# Altium schematic sheet Wifi.SchDoc
size A3
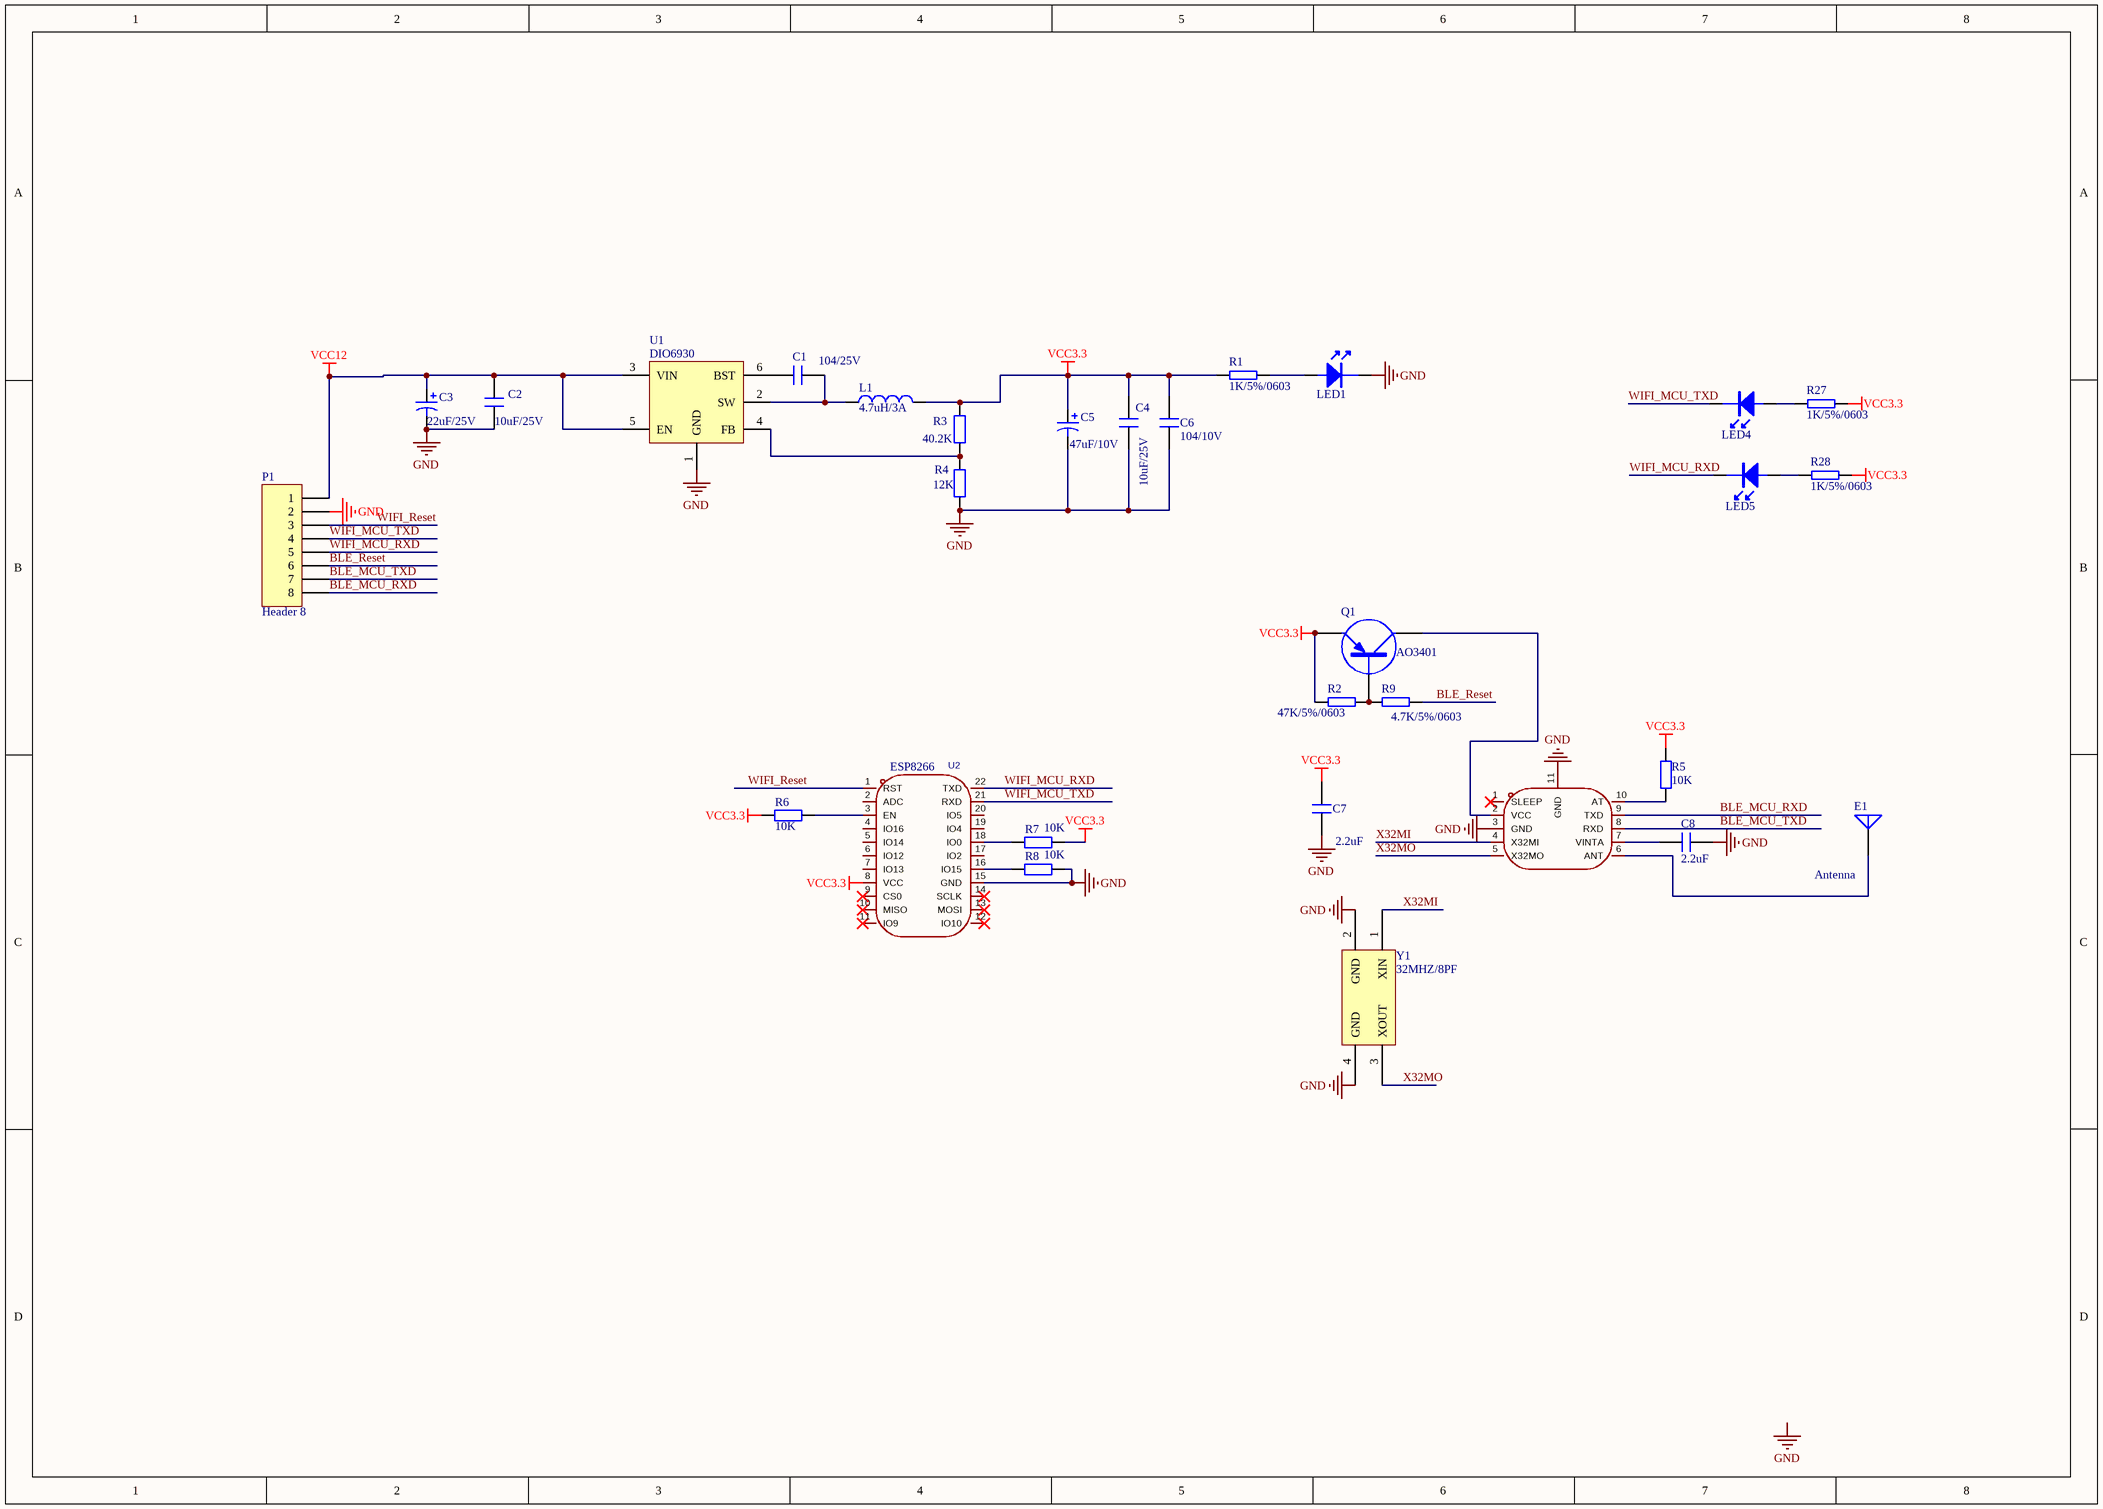
[diagram p0: Wifi.SchDoc]

## Parts
C1  104/25V  [0603R]
C2  10uF/25V  [0603R]
C3  22uF/25V  [0805R]
C4  10uF/25V  [0603R]
C5  47uF/10V  [0805R]
C6  104/10V  [0603R]
C7  2.2uF  [0603R]
C8  2.2uF  [0603R]
E1  Antenna  [ANT-F-1-2.4G-1.6mmFR4-WCH]
L1  4.7uH/3A  [CD54]
LED1  LED  [0603LED]  (value not drawn)
LED4  LED  [0603LED]  (value not drawn)
LED5  LED  [0603LED]  (value not drawn)
P1  Header 8  [HDR1X8]
Q1  AO3401  [SOT-23]
R1  1K/5%/0603  [0603R]
R2  47K/5%/0603  [0603R]
R3  40.2K  [0603R]
R4  12K  [0603R]
R5  10K  [0603R]
R6  10K  [0603R]
R7  10K  [0603R]
R8  10K  [0603R]
R9  4.7K/5%/0603  [0603R]
R27  1K/5%/0603  [0603R]
R28  1K/5%/0603  [0603R]
U1  DIO6930  [SOT-23-6DBV]
U2  ESP8266  [ESP12E]
U3  CH9141K  [CH9141K]  (value not drawn)
Y1  32MHZ/8PF  [3225]

## Nets
GND: C2.1 C3.2 C4.1 C5.2 C6.1 C7.1 C8.1 LED1.2 P1.2 R4.2 R8.2 U1.1(GND) U2.15(GND) U3.3(GND) U3.11(GND) Y1.2(GND) Y1.4(GND)
VCC3.3: C4.2 C5.1 C6.2 C7.2 L1.2 Q1.2(E) R1.1 R2.2 R3.1 R5.2 R6.1 R7.2 R27.1 R28.1 U2.8(VCC)
VCC12: C2.2 C3.1 P1.1 U1.3(VIN) U1.5(EN)
BLE_MCU_RXD: P1.8 U3.9(TXD)
BLE_MCU_TXD: P1.7 U3.8(RXD)
BLE_Reset: P1.6 R9.2
WIFI_MCU_RXD: LED5.2 P1.5 U2.22(TXD)
WIFI_MCU_TXD: LED4.2 P1.4 U2.21(RXD)
WIFI_Reset: P1.3 U2.1(RST)
X32MI: U3.4(X32MI) Y1.1(XIN)
X32MO: U3.5(X32MO) Y1.3(XOUT)
NetC1_1: C1.1 L1.1 U1.2(SW)
NetC1_2: C1.2 U1.6(BST)
NetC8_2: C8.2 U3.7(VINTA)
NetE1_1: E1.1(A) U3.6(ANT)
NetLED1_1: LED1.1 R1.2
NetLED4_1: LED4.1 R27.2
NetLED5_1: LED5.1 R28.2
NetQ1_1: Q1.1(B) R2.1 R9.1
NetQ1_3: Q1.3(C) U3.2(VCC)
NetR3_2: R3.2 R4.1 U1.4(FB)
NetR5_1: R5.1 U3.10(AT)
NetR6_2: R6.2 U2.3(EN)
NetR7_1: R7.1 U2.18(IO0)
NetR8_1: R8.1 U2.16(IO15)

Not connected (* = marked no-connect by the designer): U2 2(ADC) 4(IO16) 5(IO14) 6(IO12) 7(IO13) 9(CS0)* 10(MISO)* 11(IO9)* 12(IO10)* 13(MOSI)* 14(SCLK)* 17(IO2) 19(IO4) 20(IO5); U3 1(SLEEP)*

## Notes on the sheet
- Labels drawn without touching a wire or pin: GND

## Library data of the parts
C1 C6-C8 = CAP_1
C2 C4 = CAP
C3 C5 = Cap Pol1: Polarized Capacitor (Radial); Published: 8-Jun-2000; LatestRevisionDate: 17-Jul-2002; LatestRevisionNote: Re-released for DXP Platform.; PackageReference: RB7.6-15; Publisher: Altium Limited; PackageDescription: Polarized Capacitor (Radial); 2 Leads
E1 = Antenna: Generic Antenna; Published: 24-Mar-1999; LatestRevisionDate: 17-Jul-2002; LatestRevisionNote: Re-released for DXP Platform.; PackageReference: PIN1; Publisher: Altium Limited
L1 = Inductor: Code_IEC: 1005; Published: 8-Jun-2000; LatestRevisionDate: 29-May-2009; LatestRevisionNote: IPC-7351 Footprint Added.; PackageReference: 0402-A; Publisher: Altium Limited; PackageDescription: Chip Inductor; Code_JEITA: 0402
P1 = Header 8: Header, 8-Pin; LatestRevisionDate: 17-Jul-2002; LatestRevisionNote: Re-released for DXP Platform.; Publisher: Altium Limited
Q1 = PNP
R1 R2 R9 R27 R28 = RES
R3-R8 = Res2: Resistor; Published: 8-Jun-2000; LatestRevisionDate: 17-Jul-2002; LatestRevisionNote: Re-released for DXP Platform.; PackageReference: AXIAL-0.4; Publisher: Altium Limited; PackageDescription: Axial Device, Thru-Hole; 2 Leads; 0.4 in Pin Spacing
U1 = BL8032
U2 = ESP-12E: Symbol: ESP-12E
Y1 = 12MHz无源
U3 = CH9141K: Symbol: CH9141K